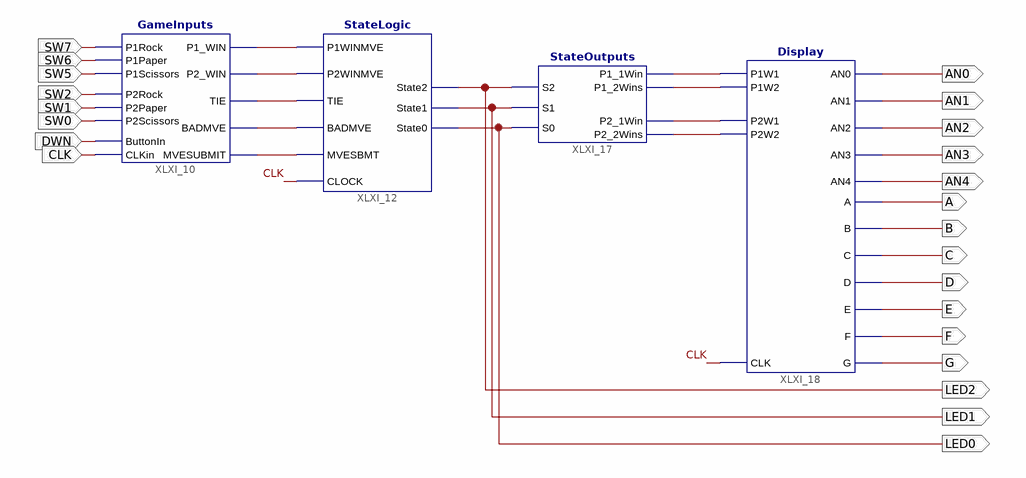
[diagram p0: schematic sheet 1]
// Xilinx ISE schematic FSM.sch (spartan6) as structural Verilog: 4 symbols, 23 ports
module FSM (
  input  CLK,
  input  SW6,
  input  SW5,
  input  SW2,
  input  SW1,
  input  SW0,
  input  DWN,
  input  SW7,
  output AN0,
  output AN2,
  output AN3,
  output AN4,
  output A,
  output B,
  output C,
  output D,
  output E,
  output F,
  output G,
  output AN1,
  output LED1,
  output LED2,
  output LED0
);

  wire XLXN_51, XLXN_52, XLXN_53, XLXN_54, XLXN_55, XLXN_71, XLXN_72, XLXN_73, XLXN_74;

  GameInputs XLXI_10 (
    .P1Rock(SW7), .P1_WIN(XLXN_51), .P2_WIN(XLXN_52), .MVESUBMIT(XLXN_53), .P1Paper(SW6), .P1Scissors(SW5),
    .P2Rock(SW2), .P2Paper(SW1), .P2Scissors(SW0), .ButtonIn(DWN), .CLKin(CLK), .BADMVE(XLXN_54),
    .TIE(XLXN_55));
  StateLogic XLXI_12 (
    .P1WINMVE(XLXN_51), .P2WINMVE(XLXN_52), .TIE(XLXN_55), .BADMVE(XLXN_54), .MVESBMT(XLXN_53), .CLOCK(CLK),
    .State1(LED1), .State2(LED2), .State0(LED0));
  StateOutputs XLXI_17 (
    .P2_1Win(XLXN_73), .P1_1Win(XLXN_71), .P2_2Wins(XLXN_74), .P1_2Wins(XLXN_72), .S2(LED2), .S1(LED1),
    .S0(LED0));
  Display XLXI_18 (
    .CLK(CLK), .P1W2(XLXN_72), .P1W1(XLXN_71), .P2W2(XLXN_74), .P2W1(XLXN_73), .AN0(AN0), .AN1(AN1),
    .AN2(AN2), .AN3(AN3), .AN4(AN4), .A(A), .B(B), .C(C), .D(D), .E(E), .F(F), .G(G));

  // Notes on the sheet:
  //   LOC on signal AN0 = P83
  //   LOC on signal AN2 = P75
  //   LOC on signal AN3 = P67
  //   LOC on signal AN4 = P79
  //   LOC on signal A = P105
  //   LOC on signal B = P115
  //   LOC on signal C = P112
  //   LOC on signal D = P97
  //   LOC on signal E = P102
  //   LOC on signal F = P111
  //   LOC on signal G = P114
  //   LOC on signal CLK = P94
  //   LOC on signal AN1 = P81
  //   LOC on signal SW6 = P59
  //   LOC on signal SW5 = P62
  //   LOC on signal SW2 = P118
  //   LOC on signal SW1 = P117
  //   LOC on signal SW0 = P116
  //   LOC on signal DWN = P133
  //   LOC on signal SW7 = P57
  //   LOC on signal LED1 = P50
  //   LOC on signal LED2 = P47
  //   LOC on signal LED0 = P55
endmodule
